# EAGLE design Keypad (EAGLE 9.6.2)
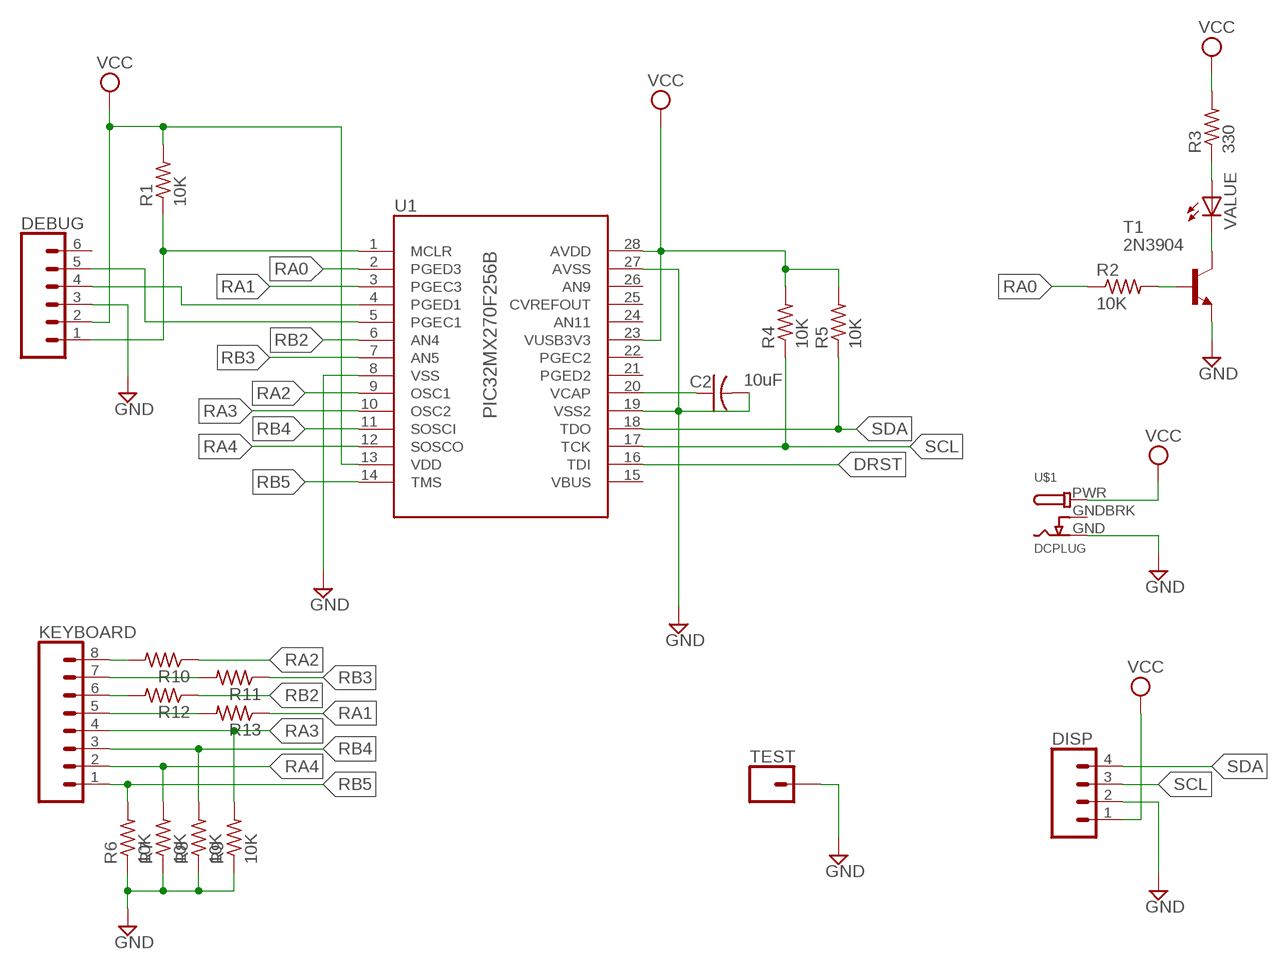
[diagram p0: schematic, sheet 1]

## Parts
C2  10uF  C-US050-024X044  [C050-024X044]
DEBUG  CONN_06LONGPADS  [1X06_LONGPADS]
DISP  CONN_04  [1X04]
KEYBOARD  CONN_08"  [1X08]
R1  10K  R-US_0207/10  [0207/10]
R2  10K  R-US_0309/10  [0309/10]
R3  330  R-US_0309/10  [0309/10]
R4  10K  R-US_0207/10  [0207/10]
R5  10K  R-US_0207/10  [0207/10]
R6  10K  R-US_0207/10  [0207/10]
R7  10K  R-US_0207/10  [0207/10]
R8  10K  R-US_0207/10  [0207/10]
R9  10K  R-US_0207/10  [0207/10]
R10  330  R-US_0309/10  [0309/10]
R11  330  R-US_0309/10  [0309/10]
R12  330  R-US_0309/10  [0309/10]
R13  330  R-US_0309/10  [0309/10]
T1  2N3904  [TO92]
TEST  CONN_01  [1X01]
U1  PIC32MX270F256B  [DIP28]
U$1  DCPLUG  [POWER_JACK_SLOT]
VALUE  LED5MM  [LED5MM]

## Nets
DRST: U1.16(TDI)
GND: C2.2 DEBUG.3 DISP.2 R6.1 R7.1 R8.1 R9.1 T1.3(E) TEST.1 U1.8(VSS) U1.19(VSS2) U1.27(AVSS) U$1.GND
N$1: DEBUG.1 R1.1 U1.1(MCLR)
N$2: C2.1 U1.20(VCAP)
N$3: KEYBOARD.8 R10.2
N$4: DEBUG.4 U1.4(PGED1)
N$5: DEBUG.5 U1.5(PGEC1)
N$6: R2.2 T1.2(B)
N$7: T1.1(C) VALUE.K(C)
N$8: R3.1 VALUE.A
N$9: KEYBOARD.7 R11.2
N$10: KEYBOARD.6 R12.2
N$11: KEYBOARD.5 R13.2
RA0: R2.1 U1.2(PGED3)
RA1: R13.1 U1.3(PGEC3)
RA2: R10.1 U1.9(OSC1)
RA3: KEYBOARD.4 R9.2 U1.10(OSC2)
RA4: KEYBOARD.2 R7.2 U1.12(SOSCO)
RB2: R12.1 U1.6(AN4)
RB3: R11.1 U1.7(AN5)
RB4: KEYBOARD.3 R8.2 U1.11(SOSCI)
RB5: KEYBOARD.1 R6.2 U1.14(TMS)
SCL: DISP.3 R4.1 U1.17(TCK)
SDA: DISP.4 R5.1 U1.18(TDO)
VCC: DEBUG.2 DISP.1 R1.2 R3.2 R4.2 R5.2 U1.13(VDD) U1.23(VUSB3V3) U1.28(AVDD) U$1.PWR
Unconnected: DEBUG.6 U1.15(VBUS) U1.21(PGED2) U1.22(PGEC2) U1.24(AN11) U1.25(CVREFOUT) U1.26(AN9)

## Power pins joined to a net without a drawn wire
GNDBREAK: U$1.GNDBRK(GNDBREAK)

## Library data of the parts
C2 = adafruit:C-US: CAPACITOR, American symbol
DEBUG = SparkFun-Connectors:CONN_06: Multi connection point. Often used as Generic Header-pin footprint for 0.1 inch spaced/style header connections On any of the 0.1 inch spaced packages, you can populate with these: Break Away Headers - Straight <https://www.sparkfun.com/products/116> (PRT-00116) Break Away Male Headers - Right Angle <https://www.sparkfun.com/products/553> (PRT-00553) Female Headers <https://www.sparkfun.com/products/115> (PRT-00115) Break Away Headers - Machine Pin <https://www.sparkfun.com/products/117> (PRT-00117) Break Away Female Headers - Swiss Machine Pin <https://www.sparkfun.com/products/743> (PRT-00743) Arduino Stackable Header - 6 Pin <https://www.sparkfun.com/products/9280> (PRT-09280) For SCREWTERMINALS and SPRING TERMINALS visit here: Screw Terimnals on SparkFun.com <https://www.sparkfun.com/search/results?term=Screw+Terminals> (5mm/3.5mm/2.54mm spacing) This device is also useful as a general connection point to wire up your design to another part of your project. Our various solder wires solder well into these plated through hole pads. Hook-Up Wire - Assortment (Stranded, 22 AWG) <https://www.sparkfun.com/products/11375> (PRT-11375) Hook-Up Wire - Assortment (Solid Core, 22 AWG) <https://www.sparkfun.com/products/11367> (PRT-11367) View the entire wire category on our website here <https://www.sparkfun.com/categories/141>
DISP = SparkFun-Connectors:CONN_04: Multi connection point. Often used as Generic Header-pin footprint for 0.1 inch spaced/style header connections On any of the 0.1 inch spaced packages, you can populate with these: Break Away Headers - Straight <https://www.sparkfun.com/products/116> (PRT-00116) Break Away Male Headers - Right Angle <https://www.sparkfun.com/products/553> (PRT-00553) Female Headers <https://www.sparkfun.com/products/115> (PRT-00115) Break Away Headers - Machine Pin <https://www.sparkfun.com/products/117> (PRT-00117) Break Away Female Headers - Swiss Machine Pin <https://www.sparkfun.com/products/743> (PRT-00743) For SCREWTERMINALS and SPRING TERMINALS visit here: Screw Terimnals on SparkFun.com <https://www.sparkfun.com/search/results?term=Screw+Terminals> (5mm/3.5mm/2.54mm spacing) This device is also useful as a general connection point to wire up your design to another part of your project. Our various solder wires solder well into these plated through hole pads. Hook-Up Wire - Assortment (Stranded, 22 AWG) <https://www.sparkfun.com/products/11375> (PRT-11375) Hook-Up Wire - Assortment (Solid Core, 22 AWG) <https://www.sparkfun.com/products/11367> (PRT-11367) View the entire wire category on our website here <https://www.sparkfun.com/categories/141> Special notes: Molex polarized connector foot print use with SKU : PRT-08231 with associated crimp pins and housings. 1MM SMD Version SKU: PRT-10208; PROD_ID: CONN-09696
KEYBOARD = SparkFun-Connectors:CONN_08: Multi connection point. Often used as Generic Header-pin footprint for 0.1 inch spaced/style header connections On any of the 0.1 inch spaced packages, you can populate with these: Break Away Headers - Straight <https://www.sparkfun.com/products/116> (PRT-00116) Break Away Male Headers - Right Angle <https://www.sparkfun.com/products/553> (PRT-00553) Female Headers <https://www.sparkfun.com/products/115> (PRT-00115) Break Away Headers - Machine Pin <https://www.sparkfun.com/products/117> (PRT-00117) Break Away Female Headers - Swiss Machine Pin <https://www.sparkfun.com/products/743> (PRT-00743) Arduino Stackable Header - 8 Pin <https://www.sparkfun.com/products/9279> (PRT-09279) For SCREWTERMINALS and SPRING TERMINALS visit here: Screw Terimnals on SparkFun.com <https://www.sparkfun.com/search/results?term=Screw+Terminals> (5mm/3.5mm/2.54mm spacing) This device is also useful as a general connection point to wire up your design to another part of your project. Our various solder wires solder well into these plated through hole pads. Hook-Up Wire - Assortment (Stranded, 22 AWG) <https://www.sparkfun.com/products/11375> (PRT-11375) Hook-Up Wire - Assortment (Solid Core, 22 AWG) <https://www.sparkfun.com/products/11367> (PRT-11367) View the entire wire category on our website here <https://www.sparkfun.com/categories/141> Special notes: Molex polarized connector foot print use with SKU : PRT-08231 with associated crimp pins and housings. 1MM SMD Version SKU: PRT-10208 NOTES ON THE VARIANTS LOCK and LOCK_LONGPADS... This footprint was designed to help hold the alignment of a through-hole component (i.e. 6-pin header) while soldering it into place. You may notice that each hole has been shifted either up or down by 0.005 of an inch from it's more standard position (which is a perfectly straight line). This slight alteration caused the pins (the squares in the middle) to touch the edges of the holes. Because they are alternating, it causes a "brace" to hold the component in place. 0.005 has proven to be the perfect amount of "off-center" position when using our standard breakaway headers. Although looks a little odd when you look at the bare footprint, once you have a header in there, the alteration is very hard to notice. Also,if you push a header all the way into place, it is covered up entirely on the bottom side.; PROD_ID: CONN-08438
R1-R13 = resistor:R-US_: RESISTOR, American symbol
T1 = transistor:2N3904: NPN TRANSISTOR
TEST = SparkFun-Connectors:CONN_01: Single connection point. Often used as Generic Header-pin footprint for 0.1 inch spaced/style header connections On any of the 0.1 inch spaced packages, you can populate with these: Break Away Headers - Straight <https://www.sparkfun.com/products/116> (PRT-00116) Break Away Male Headers - Right Angle <https://www.sparkfun.com/products/553> (PRT-00553) Female Headers <https://www.sparkfun.com/products/115> (PRT-00115) Break Away Headers - Machine Pin <https://www.sparkfun.com/products/117> (PRT-00117) Break Away Female Headers - Swiss Machine Pin <https://www.sparkfun.com/products/743> (PRT-00743) This device is also useful as a general connection point to wire up your design to another part of your project. Our various solder wires solder well into these plated through hole pads. Hook-Up Wire - Assortment (Stranded, 22 AWG) <https://www.sparkfun.com/products/11375> (PRT-11375) Hook-Up Wire - Assortment (Solid Core, 22 AWG) <https://www.sparkfun.com/products/11367> (PRT-11367) View the entire wire category on our website here <https://www.sparkfun.com/categories/141> Special notes: SMTSO-256-ET is a "flush mount" nut for a 4-40 screw. We mostly use this on specialty testbeds; it is a nice way to connect hardware to your PCB at an adjustable hieght. Also note, the SNAP packages are for using a snappable style connector. We sell a baggie of snaps and they are also used on two LilyPad designs: Snap Assortment - 30 pack (male and female) <https://www.sparkfun.com/products/11347> (DEV-11347) LilyPad Arduino SimpleSnap <https://www.sparkfun.com/products/10941> (DEV-10941) LilyPad SimpleSnap Protoboard <https://www.sparkfun.com/products/10940> (DEV-10940)
U1 = my_parts:PIC32MX270F256B
U$1 = my_parts:DCPLUG
VALUE = led:LED: LED OSRAM: - CHIPLED LG R971, LG N971, LY N971, LG Q971, LY Q971, LO R971, LY R971 LH N974, LH R974 LS Q976, LO Q976, LY Q976 LO Q996 - Hyper CHIPLED LW Q18S LB Q993, LB Q99A, LB R99A - SideLED LS A670, LO A670, LY A670, LG A670, LP A670 LB A673, LV A673, LT A673, LW A673 LH A674 LY A675 LS A676, LA A676, LO A676, LY A676, LW A676 LS A679, LY A679, LG A679 - Hyper Micro SIDELED® LS Y876, LA Y876, LO Y876, LY Y876 LT Y87S - SmartLED LW L88C, LW L88S LB L89C, LB L89S, LG L890 LS L89K, LO L89K, LY L89K LS L896, LA L896, LO L896, LY L896 - TOPLED LS T670, LO T670, LY T670, LG T670, LP T670 LSG T670, LSP T670, LSY T670, LOP T670, LYG T670 LG T671, LOG T671, LSG T671 LB T673, LV T673, LT T673, LW T673 LH T674 LS T676, LA T676, LO T676, LY T676, LB T676, LH T676, LSB T676, LW T676 LB T67C, LV T67C, LT T67C, LS T67K, LO T67K, LY T67K, LW E67C LS E67B, LA E67B, LO E67B, LY E67B, LB E67C, LV E67C, LT E67C LW T67C LS T679, LY T679, LG T679 LS T770, LO T770, LY T770, LG T770, LP T770 LB T773, LV T773, LT T773, LW T773 LH T774 LS E675, LA E675, LY E675, LS T675 LS T776, LA T776, LO T776, LY T776, LB T776 LHGB T686 LT T68C, LB T68C - Hyper Mini TOPLED® LB M676 - Mini TOPLED Santana® LG M470 LS M47K, LO M47K, LY M47K Source: http://www.osram.convergy.de LUXEON: - LUMILED® LXK2-PW12-R00, LXK2-PW12-S00, LXK2-PW14-U00, LXK2-PW14-V00 LXK2-PM12-R00, LXK2-PM12-S00, LXK2-PM14-U00 LXK2-PE12-Q00, LXK2-PE12-R00, LXK2-PE12-S00, LXK2-PE14-T00, LXK2-PE14-U00 LXK2-PB12-K00, LXK2-PB12-L00, LXK2-PB12-M00, LXK2-PB14-N00, LXK2-PB14-P00, LXK2-PB14-Q00 LXK2-PR12-L00, LXK2-PR12-M00, LXK2-PR14-Q00, LXK2-PR14-R00 LXK2-PD12-Q00, LXK2-PD12-R00, LXK2-PD12-S00 LXK2-PH12-R00, LXK2-PH12-S00 LXK2-PL12-P00, LXK2-PL12-Q00, LXK2-PL12-R00 Source: www.luxeon.com KINGBRIGHT: KA-3528ASYC Source: www.kingbright.com

## Board
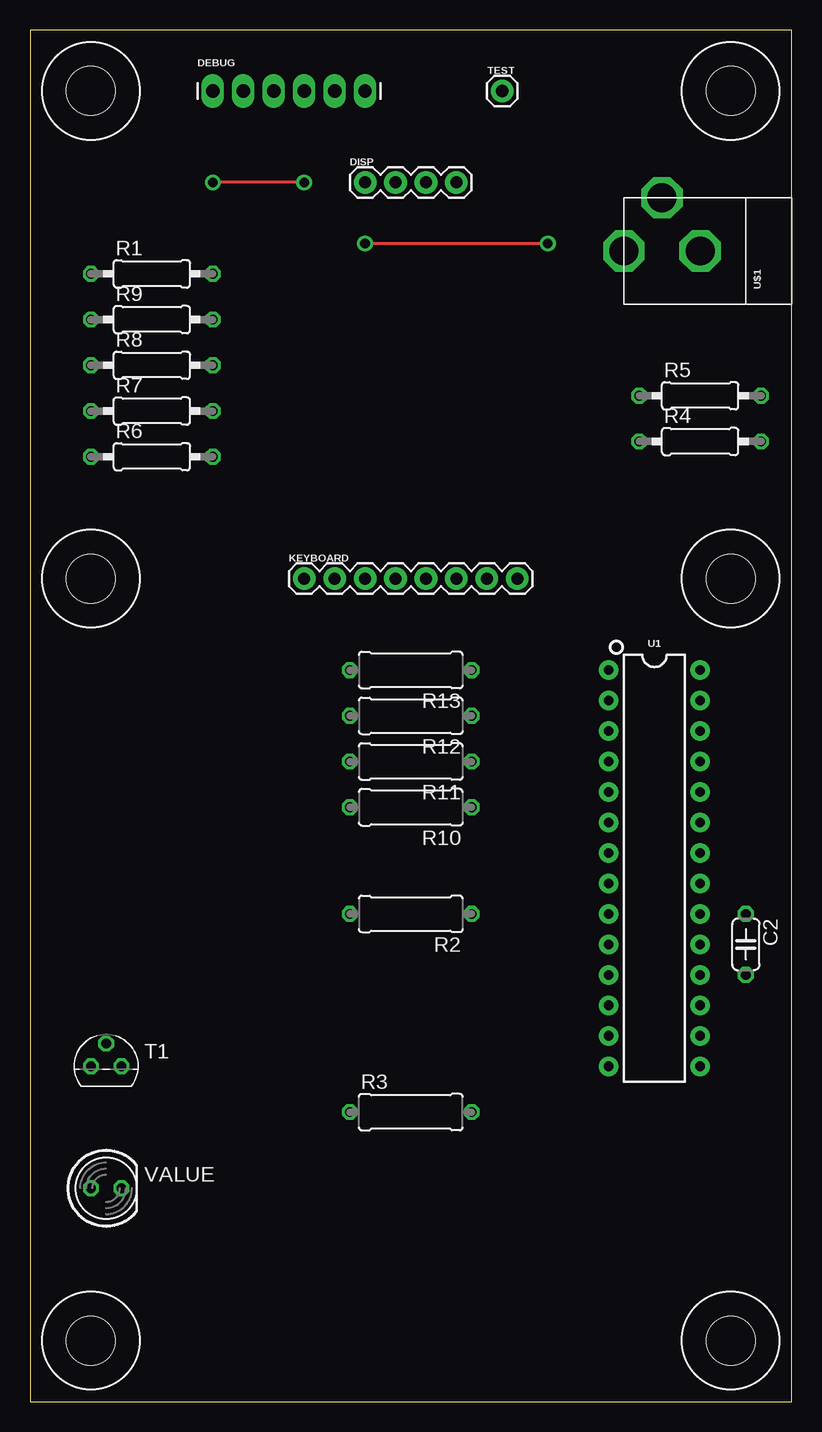
[diagram p1: board, top side]
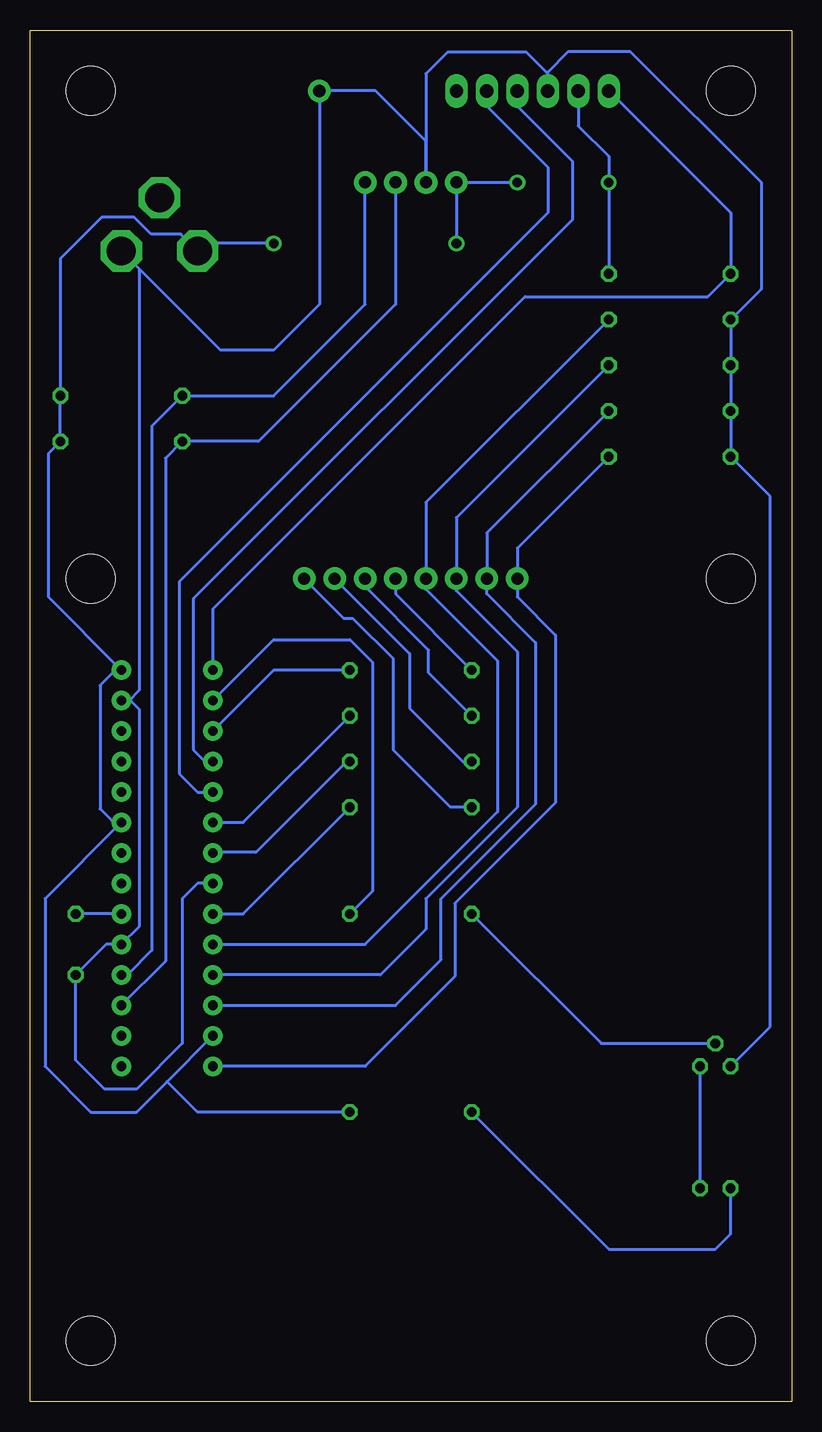
[diagram p2: board, bottom side, seen from below]

Size 63.5 x 114.3 mm. Coordinates in mm from the lower left corner, seen from the top.
Outline: 0,0 63.5,0 63.5,114.3 0,114.3 0,0
Copper layers (1*16): Top 0.035mm / dielectric 1.5mm / Bottom 0.035mm
Design rules "MyRules64": minimum track width 10mil, minimum drill 0.8mm, track to track 18mil, track to pad 18mil, pad to pad 18mil, via to via 18mil, smd to smd 0mil, copper to edge 0mil, drill to drill 6mil, minimum pad ring 10mil, minimum via ring 10mil, stop-mask expansion 1mil, vias tented up to drill 30mil, thermal gap 6mil
Holes 4.06 mm at 5.08,109.22 58.42,109.22 58.42,5.08 5.08,5.08 5.08,68.58 58.42,68.58

### Footprints (pad centres in the part's own frame; a part is rotated, then mirrored left to right if it is on the bottom)
C050-024X044 = drill 0.813 octagon: 1 -2.54,0; 2 2.54,0
1X06_LONGPADS = drill 1.118 pad 1.88 long: 1 0,0; 2 2.54,0; 3 5.08,0; 4 7.62,0; 5 10.16,0; 6 12.7,0
1X04 = drill 1.016 pad 1.88: 1 0,0; 2 2.54,0; 3 5.08,0; 4 7.62,0
1X08 = drill 1.016 pad 1.88: 1 0,0; 2 2.54,0; 3 5.08,0; 4 7.62,0; 5 10.16,0; 6 12.7,0; 7 15.24,0; 8 17.78,0
0207/10 = drill 0.813 octagon: 1 -5.08,0; 2 5.08,0
0309/10 = drill 0.813 octagon: 1 -5.08,0; 2 5.08,0
TO92 = drill 0.813 octagon: 1 1.27,0; 2 0,1.905; 3 -1.27,0
1X01 = drill 1.016 pad 1.88: 1 0,0
DIP28 = drill 0.813 pad 1.626: 1 -16.51,-3.81; 2 -13.97,-3.81; 3 -11.43,-3.81; 4 -8.89,-3.81; 5 -6.35,-3.81; 6 -3.81,-3.81; 7 -1.27,-3.81; 8 1.27,-3.81; 9 3.81,-3.81; 10 6.35,-3.81; 11 8.89,-3.81; 12 11.43,-3.81; 13 13.97,-3.81; 14 16.51,-3.81; 15 16.51,3.81; 16 13.97,3.81; 17 11.43,3.81; 18 8.89,3.81; 19 6.35,3.81; 20 3.81,3.81; 21 1.27,3.81; 22 -1.27,3.81; 23 -3.81,3.81; 24 -6.35,3.81; 25 -8.89,3.81; 26 -11.43,3.81; 27 -13.97,3.81; 28 -16.51,3.81
POWER_JACK_SLOT = drill 2.413 pad 3.429 octagon: GND 4.445,7.62; GNDBRK 8.89,10.795; PWR 4.445,13.97
LED5MM = drill 0.813 octagon: A -1.27,0; K 1.27,0

### Placement (x,y rotation side)
C2  59.69,38.1 270 top
DEBUG  15.24,109.22 0 top
DISP  27.94,101.6 0 top
KEYBOARD  22.86,68.58 0 top
R1  10.16,93.98 0 top
R2  31.75,40.64 180 top
R3  31.75,24.13 0 top
R4  55.88,80.01 0 top
R5  55.88,83.82 0 top
R6  10.16,78.74 0 top
R7  10.16,82.55 0 top
R8  10.16,86.36 0 top
R9  10.16,90.17 0 top
R10  31.75,49.53 180 top
R11  31.75,53.34 180 top
R12  31.75,57.15 180 top
R13  31.75,60.96 180 top
T1  6.35,27.94 0 top
TEST  39.37,109.22 0 top
U1  52.07,44.45 270 top
U$1  63.5,91.44 90 top
VALUE  6.35,17.78 0 top

### Tracks (layer width: path | path; a pad name or v marks a point on that pad's centre or on a via)
GND
  Bottom 0.254: U1.8 49.53,43.18 50.8,41.91 50.8,29.84 54.61,26.04 57.28,26.04 59.69,28.45 C2.2 57.15,38.1 U1.19 54.36,39.62 54.36,57.66 55.12,58.42 U1.27 55.24,58.42 54.36,59.31 54.36,94.36 U$1.GND 47.62,87.63 43.18,87.63 39.37,91.44 TEST.1 34.67,109.22 30.48,105.03 DISP.2 30.48,110.66 28.7,112.45 22.1,112.45 20.32,110.66 DEBUG.3 20.32,110.79 18.59,112.52 13.46,112.52 2.54,101.6 2.54,92.71 R9.1 R8.1 R7.1 R6.1 1.78,75.44 1.78,31.24 T1.3
N$1
  Bottom 0.254: U1.1 48.26,66.04 22.23,92.08 6.99,92.08 R1.1 5.08,99.06 DEBUG.1
N$2
  Bottom 0.254: U1.20 C2.1
N$3
  Bottom 0.254: R10.2 28.45,49.53 33.2,54.28 33.2,61.89 36.59,65.28 37.34,65.28 KEYBOARD.8
N$4
  Bottom 0.254: U1.4 48.9,53.34 49.84,54.28 49.84,66.93 18.29,98.48 18.29,103.38 22.86,107.95 DEBUG.4
N$5
  Bottom 0.254: DEBUG.5 25.4,107.95 20.32,102.87 20.32,99.06 51.05,68.33 51.05,52.32 49.53,50.8 U1.5
N$6
  Bottom 0.254: R2.2 15.88,29.84 T1.2
N$7
  Bottom 0.254: VALUE.K T1.1
N$8
  Bottom 0.254: R3.1 15.24,12.7 6.35,12.7 5.08,13.97 VALUE.A
N$9
  Bottom 0.254: KEYBOARD.7 31.85,62.33 31.85,57.78 27.41,53.34 R11.2
N$10
  Bottom 0.254: R12.2 30.25,60.73 30.25,62.63 35.56,67.94 KEYBOARD.6
N$11
  Bottom 0.254: KEYBOARD.5 33.02,67.31 R13.2
RA0
  Bottom 0.254: U1.2 43.18,63.5 36.83,63.5 34.92,61.59 34.92,42.55 R2.1
RA1
  Bottom 0.254: R13.1 43.18,60.96 U1.3
RA2
  Bottom 0.254: U1.9 45.72,40.64 R10.1
RA3
  Bottom 0.254: R9.2 30.48,74.93 KEYBOARD.4 30.48,67.69 24.51,61.72 24.51,49.15 35.56,38.1 U1.10
RA4
  Bottom 0.254: R7.2 25.4,72.39 KEYBOARD.2 25.4,67.31 21.34,63.25 21.34,49.78 29.21,41.91 29.21,36.83 33.02,33.02 U1.12
RB2
  Bottom 0.254: U1.6 45.72,48.26 R12.1
RB3
  Bottom 0.254: R11.1 37.09,53.34 44.66,45.77 48.21,45.77 U1.7
RB4
  Bottom 0.254: R8.2 27.94,73.66 KEYBOARD.3 27.94,67.56 22.86,62.48 22.86,49.53 30.48,41.91 30.48,39.37 34.29,35.56 U1.11
RB5
  Bottom 0.254: R6.2 22.86,71.12 KEYBOARD.1 22.86,67.06 19.68,63.88 19.68,49.91 28.07,41.53 28.07,35.43 35.56,27.94 U1.14
SCL
  Bottom 0.254: DISP.3 33.02,91.44 44.45,80.01 R4.1 52.2,78.61 52.2,36.7 U1.17
SDA
  Bottom 0.254: DISP.4 35.56,91.44 43.18,83.82 R5.1 53.34,81.28 53.34,37.59 55.37,35.56 U1.18
VCC  (via drill 0.8)
  Top 0.254: v22.86,101.6 v15.24,101.6 | v27.94,96.52 v43.18,96.52
  Bottom 0.254: U$1.PWR 49.85,96.2 | 49.85,96.2 50.93,97.28 53.39,97.28 54.8,98.69 57.52,98.69 60.96,95.25 R5.2 R4.2 61.98,78.99 61.98,67.06 U1.28 56.39,60.96 57.66,59.69 57.66,49.4 56.52,48.26 U1.23 62.23,41.91 62.23,27.94 58.42,24.13 54.61,24.13 52.07,26.67 | v22.86,101.6 DISP.1 v27.94,96.52 | DEBUG.2 17.78,106.3 15.24,103.76 v15.24,101.6 R1.2 | 52.07,26.67 U1.13 | v43.18,96.52 49.53,96.52 49.85,96.2 | R3.2 49.53,24.13 52.07,26.67